# EAGLE design double-tube-iv (EAGLE 6.6.0)
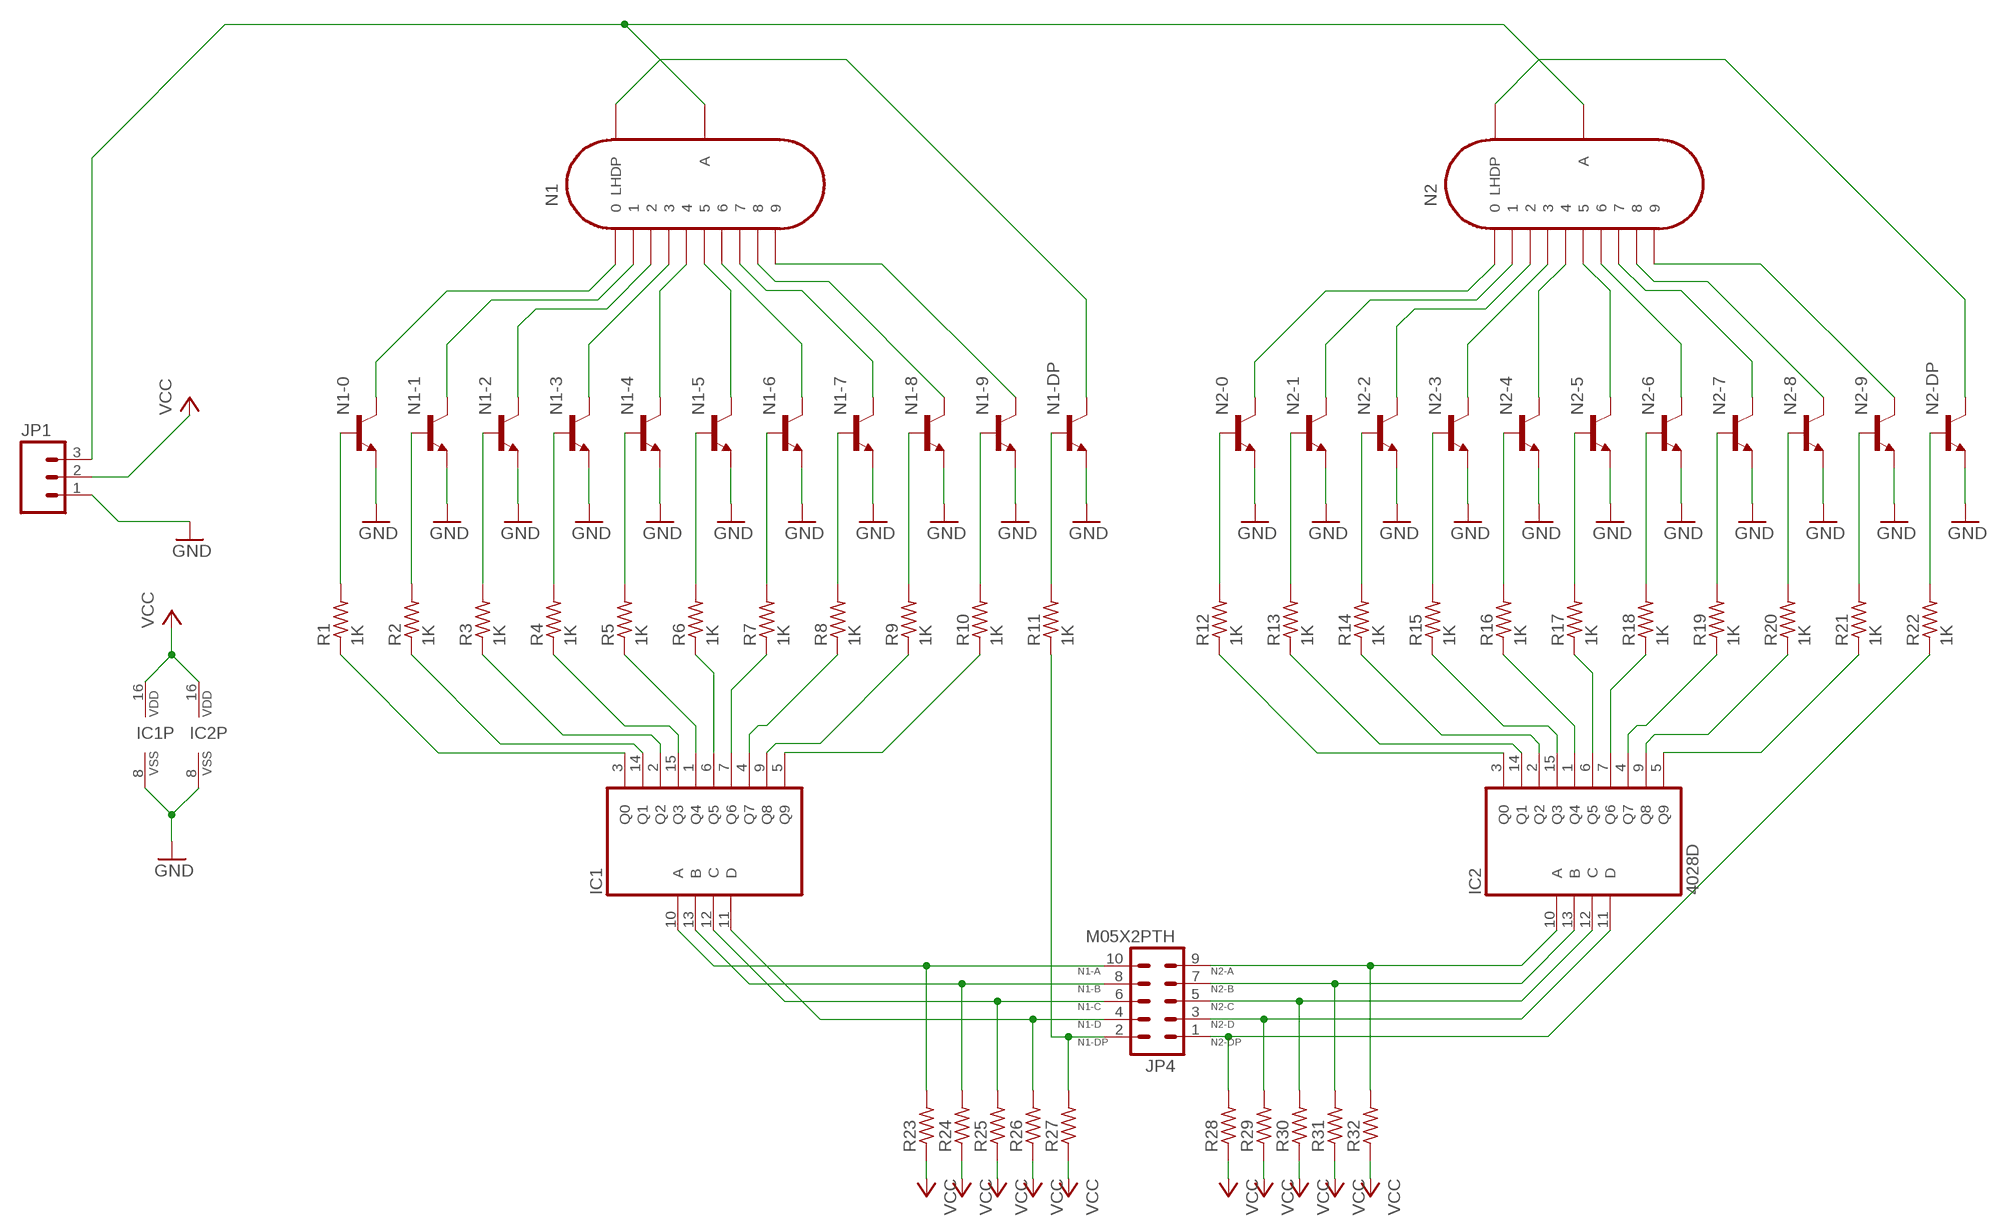
[diagram p0: schematic, sheet 1]

## Parts
IC1  4028D  [SO16]
IC2  4028D  [SO16]
JP1  M03PTH  [1X03]
JP4  M05X2PTH  [AVR_ICSP]
N1  IN-12B  [IN-12]
N1-0  NPN_SMD  [SOT-23]
N1-1  NPN_SMD  [SOT-23]
N1-2  NPN_SMD  [SOT-23]
N1-3  NPN_SMD  [SOT-23]
N1-4  NPN_SMD  [SOT-23]
N1-5  NPN_SMD  [SOT-23]
N1-6  NPN_SMD  [SOT-23]
N1-7  NPN_SMD  [SOT-23]
N1-8  NPN_SMD  [SOT-23]
N1-9  NPN_SMD  [SOT-23]
N1-DP  NPN_SMD  [SOT-23]
N2  IN-12B  [IN-12]
N2-0  NPN_SMD  [SOT-23]
N2-1  NPN_SMD  [SOT-23]
N2-2  NPN_SMD  [SOT-23]
N2-3  NPN_SMD  [SOT-23]
N2-4  NPN_SMD  [SOT-23]
N2-5  NPN_SMD  [SOT-23]
N2-6  NPN_SMD  [SOT-23]
N2-7  NPN_SMD  [SOT-23]
N2-8  NPN_SMD  [SOT-23]
N2-9  NPN_SMD  [SOT-23]
N2-DP  NPN_SMD  [SOT-23]
R1  1K  RESISTORR0603  [R0603]
R2  1K  RESISTORR0603  [R0603]
R3  1K  RESISTORR0603  [R0603]
R4  1K  RESISTORR0603  [R0603]
R5  1K  RESISTORR0603  [R0603]
R6  1K  RESISTORR0603  [R0603]
R7  1K  RESISTORR0603  [R0603]
R8  1K  RESISTORR0603  [R0603]
R9  1K  RESISTORR0603  [R0603]
R10  1K  RESISTORR0603  [R0603]
R11  1K  RESISTORR0603  [R0603]
R12  1K  RESISTORR0603  [R0603]
R13  1K  RESISTORR0603  [R0603]
R14  1K  RESISTORR0603  [R0603]
R15  1K  RESISTORR0603  [R0603]
R16  1K  RESISTORR0603  [R0603]
R17  1K  RESISTORR0603  [R0603]
R18  1K  RESISTORR0603  [R0603]
R19  1K  RESISTORR0603  [R0603]
R20  1K  RESISTORR0603  [R0603]
R21  1K  RESISTORR0603  [R0603]
R22  1K  RESISTORR0603  [R0603]
R23  RESISTORR0603  [R0603]
R24  RESISTORR0603  [R0603]
R25  RESISTORR0603  [R0603]
R26  RESISTORR0603  [R0603]
R27  RESISTORR0603  [R0603]
R28  RESISTORR0603  [R0603]
R29  RESISTORR0603  [R0603]
R30  RESISTORR0603  [R0603]
R31  RESISTORR0603  [R0603]
R32  RESISTORR0603  [R0603]

## Nets
180V: JP1.3 N1.A N2.A
GND: IC1.8(VSS) IC2.8(VSS) JP1.1 N1-0.2(E) N1-1.2(E) N1-2.2(E) N1-3.2(E) N1-4.2(E) N1-5.2(E) N1-6.2(E) N1-7.2(E) N1-8.2(E) N1-9.2(E) N1-DP.2(E) N2-0.2(E) N2-1.2(E) N2-2.2(E) N2-3.2(E) N2-4.2(E) N2-5.2(E) N2-6.2(E) N2-7.2(E) N2-8.2(E) N2-9.2(E) N2-DP.2(E)
N1-A: IC1.10(A) JP4.10 R23.2
N1-B: IC1.13(B) JP4.8 R24.2
N1-C: IC1.12(C) JP4.6 R25.2
N1-D: IC1.11(D) JP4.4 R26.2
N1-DP: JP4.2 R11.1 R27.2
N2-0: N2-0.3(C) N2.0
N2-A: IC2.10(A) JP4.9 R32.2
N2-B: IC2.13(B) JP4.7 R31.2
N2-C: IC2.12(C) JP4.5 R30.2
N2-D: IC2.11(D) JP4.3 R29.2
N2-DP: JP4.1 R22.1 R28.2
N$1: N1-0.3(C) N1.0
N$2: N1-1.3(C) N1.1
N$3: N1-2.3(C) N1.2
N$4: N1-3.3(C) N1.3
N$5: N1-4.3(C) N1.4
N$6: N1-9.3(C) N1.9
N$7: N1-8.3(C) N1.8
N$8: N1-7.3(C) N1.7
N$9: N1-6.3(C) N1.6
N$10: N1-5.3(C) N1.5
N$11: N1-DP.3(C) N1.LHDP
N$12: N1-0.1(B) R1.2
N$13: N1-1.1(B) R2.2
N$14: N1-2.1(B) R3.2
N$15: N1-3.1(B) R4.2
N$16: N1-4.1(B) R5.2
N$17: N1-5.1(B) R6.2
N$18: N1-9.1(B) R10.2
N$19: N1-6.1(B) R7.2
N$20: N1-7.1(B) R8.2
N$21: N1-8.1(B) R9.2
N$22: IC1.3(Q0) R1.1
N$23: IC1.14(Q1) R2.1
N$28: N1-DP.1(B) R11.2
N$29: IC1.2(Q2) R3.1
N$30: N2-1.3(C) N2.1
N$31: N2-2.3(C) N2.2
N$32: N2-3.3(C) N2.3
N$33: N2-4.3(C) N2.4
N$34: N2-9.3(C) N2.9
N$35: N2-8.3(C) N2.8
N$36: N2-7.3(C) N2.7
N$37: N2-6.3(C) N2.6
N$38: N2-5.3(C) N2.5
N$39: N2-DP.3(C) N2.LHDP
N$40: N2-0.1(B) R12.2
N$41: N2-1.1(B) R13.2
N$42: N2-2.1(B) R14.2
N$43: N2-3.1(B) R15.2
N$44: N2-4.1(B) R16.2
N$45: N2-5.1(B) R17.2
N$46: N2-9.1(B) R21.2
N$47: N2-6.1(B) R18.2
N$48: N2-7.1(B) R19.2
N$49: N2-8.1(B) R20.2
N$50: IC1.15(Q3) R4.1
N$55: N2-DP.1(B) R22.2
N$56: IC1.1(Q4) R5.1
N$57: IC1.6(Q5) R6.1
N$58: IC1.7(Q6) R7.1
N$59: IC1.5(Q9) R10.1
N$60: IC1.9(Q8) R9.1
N$61: IC1.4(Q7) R8.1
N$63: IC2.3(Q0) R12.1
N$64: IC2.14(Q1) R13.1
N$65: IC2.2(Q2) R14.1
N$66: IC2.15(Q3) R15.1
N$67: IC2.1(Q4) R16.1
N$68: IC2.6(Q5) R17.1
N$69: IC2.7(Q6) R18.1
N$70: IC2.5(Q9) R21.1
N$71: IC2.9(Q8) R20.1
N$72: IC2.4(Q7) R19.1
VCC: IC1.16(VDD) IC2.16(VDD) JP1.2 R23.1 R24.1 R25.1 R26.1 R27.1 R28.1 R29.1 R30.1 R31.1 R32.1

## Library data of the parts
IC1 IC2 = iStivi - ICs:4028: BCD to decimal DECODER
JP1 = iStivi - Header-Connector:M03: Header 3 Standard 3-pin 0.1" header. Use with straight break away headers (SKU : PRT-00116), right angle break away headers (PRT-00553), swiss pins (PRT-00743), machine pins (PRT-00117), and female headers (PRT-00115). Molex polarized connector foot print use with SKU : PRT-08232 with associated crimp pins and housings.
JP4 = iStivi - Header-Connector:M05X2: Header 5x2 Standard 10-pin dual row 0.1" header. Commonly used with AVR-ISP. Use with Spark Fun Electronics SKU: PRT-00778
N1 N2 = iStivi - Tubes:IN-12B: IN-12B: medium numeric topview nixie tube
N1-0 N1-1-N1-9 N1-DP N2-0 N2-1-N2-9 N2-DP = iStivi - Transistor-FET-reg:NPN_SMD: NPN Transistor NPN transistor with smd package BC817 PMBTA42
R1-R32 = iStivi - RCLD:RESISTOR: RESISTOR

## Board
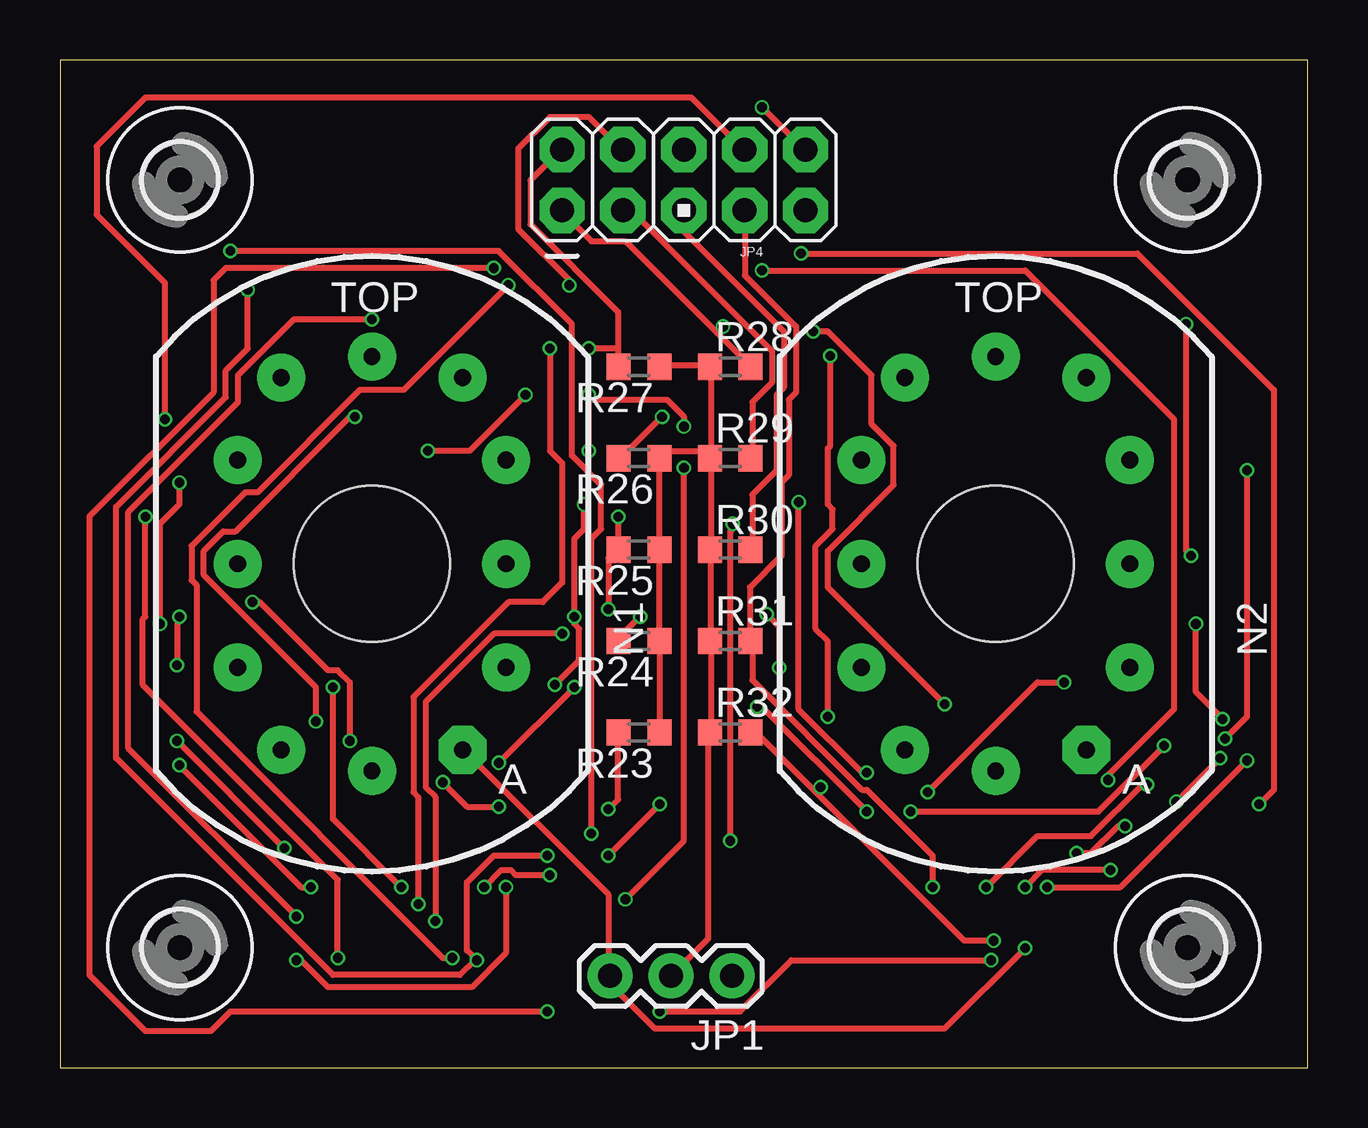
[diagram p1: board, top side]
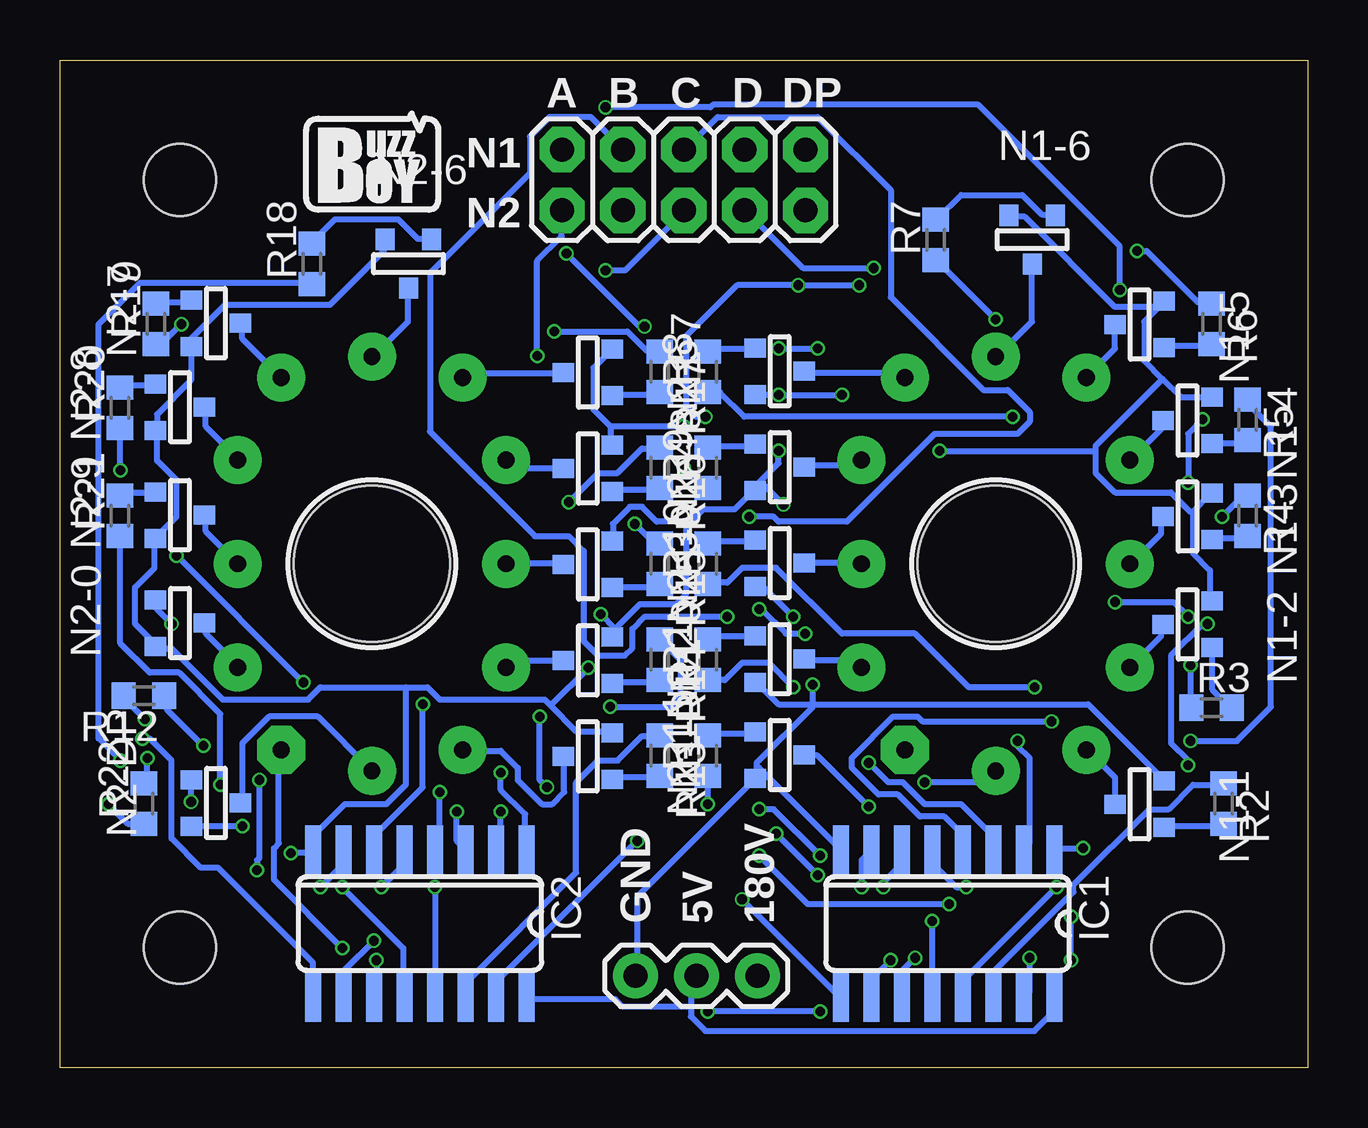
[diagram p2: board, bottom side, seen from below]

Size 52 x 42 mm. Coordinates in mm from the lower left corner, seen from the top.
Outline: 0,0 52,0 52,42 0,42 0,0
Copper layers (1*16): Top 0.035mm / dielectric 1.5mm / Bottom 0.035mm
Design rules "default *": minimum track width 10mil, minimum drill 0.4mm, track to track 8mil, track to pad 8mil, pad to pad 8mil, via to via 8mil, smd to smd 8mil, copper to edge 40mil, drill to drill 8mil, minimum pad ring 10mil, minimum via ring 4mil, stop-mask expansion 4mil, vias tented up to drill 0.5mm, thermal gap 10mil
Holes 6.5 mm at 13,21 39,21

### Footprints (pad centres in the part's own frame; a part is rotated, then mirrored left to right if it is on the bottom)
SO16 = smd 0.66 x 2.032: 1 -4.445,-3.073; 2 -3.175,-3.073; 3 -1.905,-3.073; 4 -0.635,-3.073; 5 0.635,-3.073; 6 1.905,-3.073; 7 3.175,-3.073; 8 4.445,-3.073; 9 4.445,3.073; 10 3.175,3.073; 11 1.905,3.073; 12 0.635,3.073; 13 -0.635,3.073; 14 -1.905,3.073; 15 -3.175,3.073; 16 -4.445,3.073
1X03 = drill 1 pad 1.88: 1 0,0; 2 2.54,0; 3 5.08,0
AVR_ICSP = drill 1 pad 1.88 octagon: 1 -1.27,5.08; 2 1.27,5.08; 3 -1.27,2.54; 4 1.27,2.54; 5 -1.27,0; 6 1.27,0; 7 -1.27,-2.54; 8 1.27,-2.54; 9 -1.27,-5.08; 10 1.27,-5.08
IN-12 = drill 0.7 pad 2: 0 5.59,-4.32; 1 -3.78,-7.766; 2 -5.59,-4.32; 3 -5.59,0; 4 -5.59,4.32; 5 -3.78,7.766; 6 0,8.64; 7 3.78,7.766; 8 5.59,4.32; 9 5.59,0; LHDP 0,-8.64 | drill 0.7 pad 2 octagon: A 3.78,-7.766
SOT-23 = smd 0.787 x 0.889: 1 0.991,1.016; 2 -0.94,1.016; 3 0.025,-1.016
R0603 = smd 1 x 1.1: 1 -0.85,0; 2 0.85,0
3,0-SMALL = hole 3: 0,0

### Placement (x,y rotation side)
IC1  15,6 180 bottom
IC2  37,6 180 bottom
JP1  28.01,3.82 180 top
JP4  26,37 90 top
N1  13,21 0 top
N1-0  22,17 90 bottom
N1-1  7,11 270 bottom
N1-2  5,18.5 270 bottom
N1-3  5,23 270 bottom
N1-4  5,27 270 bottom
N1-5  7,31 270 bottom
N1-6  11.5,34.51 0 bottom
N1-7  22,29 90 bottom
N1-8  22,25 90 bottom
N1-9  22,21 90 bottom
N1-DP  22,13 90 bottom
N2  39,21 0 top
N2-0  47,18.5 90 bottom
N2-1  30,13 270 bottom
N2-2  30,17 270 bottom
N2-3  30,21 270 bottom
N2-4  30,25 270 bottom
N2-5  30,29 270 bottom
N2-6  37.5,33.51 0 bottom
N2-7  45.5,31 90 bottom
N2-8  47,27.5 90 bottom
N2-9  47,23 90 bottom
N2-DP  45.5,11 90 bottom
R1  25,17 90 bottom
R2  3.5,11 270 bottom
R3  4,15 0 bottom
R4  2.5,23 270 bottom
R5  2.5,27 270 bottom
R6  4,31 270 bottom
R7  15.5,34.5 90 bottom
R8  25,29 90 bottom
R9  25,25 90 bottom
R10  25,21 90 bottom
R11  25,13 90 bottom
R12  48.5,15.5 180 bottom
R13  27,13 270 bottom
R14  27,17 270 bottom
R15  27,21 270 bottom
R16  27,25 270 bottom
R17  27,29 270 bottom
R18  41.5,33.5 90 bottom
R19  48,31 90 bottom
R20  49.5,27.5 90 bottom
R21  49.5,23 90 bottom
R22  48.5,11 90 bottom
R23  24.13,13.97 180 top
R24  24.13,17.78 180 top
R25  24.13,21.59 180 top
R26  24.13,25.4 180 top
R27  24.13,29.21 180 top
R28  27.94,29.21 0 top
R29  27.94,25.4 0 top
R30  27.94,21.59 0 top
R31  27.94,17.78 0 top
R32  27.94,13.97 0 top
U$1  [BUZZBOY-SILK]  25.71,8.65 0 top
U$2  [3,0-SMALL]  5,37 0 top
U$3  [3,0-SMALL]  47,37 0 top
U$4  [3,0-SMALL]  47,5 0 top
U$5  [3,0-SMALL]  5,5 0 top
U$6  [BUZZBOY-SILK-BOTTOM]  39.37,38.1 0 bottom

### Tracks (layer width: path | path; a pad name or v marks a point on that pad's centre or on a via)
180V  (via drill 0.4)
  Top 0.254: N1.A 16.87,13.21 22.86,7.21 22.86,3.86 JP1.3 22.96,3.76 22.96,3.45 24.79,1.63 36.88,1.63 v40.23,4.98
  Bottom 0.254: v40.23,4.98 43.08,7.82 43.08,9.14 42.88,9.35 42.88,13.21 N2.A
GND  (via drill 0.4)
  Top 0.254: v44.4,10.06 44.09,10.06 42.98,8.94 v42.37,8.94 | v22.05,25.7 v22.05,28.04 22.15,27.84 25.3,27.84 26.01,27.13 v26.01,26.72 | v20.62,15.95 21.64,16.97 21.64,18.29 21.44,18.49 v21.44,18.8 21.44,22.05 21.84,22.45 v21.84,23.47 | v15.34,25.7 17.07,25.7 v19.41,28.04 | v29.97,16.66 29.97,18.39 v29.46,18.9
  Bottom 0.254: N2-6.2 38.51,34.44 38.51,34.04 40.74,31.8 45.11,31.8 46.53,30.38 46.53,30.18 N2-7.2 46.53,29.97 46.53,28.65 47.95,27.23 47.95,26.62 N2-8.2 47.95,26.52 47.95,25.3 47.14,24.49 47.14,22.96 47.95,22.15 N2-9.2 48.06,22.05 48.06,20.83 48.87,20.02 48.87,18.49 48.06,17.68 N2-0.2 47.95,17.48 47.35,17.48 45.21,15.34 41.66,15.34 41.15,15.85 37.59,15.85 | v44.4,10.06 46.43,10.06 N2-DP.2 | v42.37,8.94 41.55,8.94 41.45,9.04 IC2.8 41.35,9.14 41.35,9.75 40.13,10.97 38.41,10.97 37.59,11.79 37.59,15.85 | 31.55,15.09 31.8,15.34 36.17,15.34 36.68,15.85 37.59,15.85 | 31.55,15.09 30.48,14.02 29.06,14.02 N2-1.2 | 4.78,23.16 4.78,21.44 4.06,20.73 4.06,19.51 N1-2.2 | 4.78,23.16 4.06,23.88 N1-3.2 | 6.04,28.7 6.81,29.46 6.81,31.09 5.99,31.9 N1-5.2 6.3,31.7 8.03,31.7 11.79,35.46 12.39,35.46 N1-6.2 | 6.04,28.7 5.28,27.94 4.06,27.94 N1-4.2 | 8.84,25.7 8.84,25.91 6.04,28.7 | 8.84,25.7 8.84,24.79 8.03,23.98 5.69,23.98 4.88,23.16 4.78,23.16 | 29.06,26.72 29.06,26.01 N2-4.2 | 29.06,26.72 29.77,27.43 29.77,29.16 29.06,29.87 N2-5.2 | 28.85,18.29 27.84,19.3 26.31,19.3 25.91,19.71 25.91,22.55 25.76,22.71 | 28.85,18.29 28.96,18.19 28.96,17.98 N2-2.2 28.85,18.29 | 25.76,22.71 25.2,23.27 23.88,23.27 23.06,24.08 N1-8.2 | N2-3.2 28.96,21.95 28.96,22.66 28.25,23.37 27.74,23.37 27.13,22.76 25.81,22.76 25.76,22.71 | v22.05,25.7 22.05,25.2 23.06,24.18 N1-8.2 | N1-7.2 22.96,28.04 v22.05,28.04 v19.41,28.04 | v26.01,26.72 29.06,26.72 | 20.62,15.14 22.05,15.14 22.96,16.05 N1-0.2 | 20.62,15.14 9.14,15.14 5.99,11.99 N1-1.2 | 22.96,12.5 22.96,12.7 20.62,15.04 20.62,15.14 | 22.96,12.5 22.96,12.09 N1-DP.2 23.06,11.99 27.94,7.11 27.94,3.86 JP1.1
  Bottom 0.254: v21.44,18.8 22.66,20.02 22.96,20.02 N1-9.2 | 20.62,15.14 v20.62,15.95 | IC1.8 19.51,9.14 22.86,12.5 22.96,12.5 | v21.84,23.47 22.76,24.38 N1-8.2 | v15.34,25.7 8.84,25.7 | v29.97,16.66 31.55,15.09 | 28.85,18.29 v29.46,18.9
N1-A  (via drill 0.4)
  Top 0.254: v22.86,10.77 23.27,11.18 23.27,13.92 R23.2 | v20.32,8.84 18.09,8.84 16.97,7.72 16.97,4.88 v17.37,4.47 17.27,4.47 16.66,3.86 11.38,3.86 2.34,12.9 2.34,23.37 6.91,27.94 6.91,29.06 7.82,29.97 v7.82,32.41 | v29.26,40.03 30.99,38.3 JP4.10
  Bottom 0.254: v22.86,10.77 22.25,10.77 v20.32,8.84 | v17.37,4.47 18.09,3.76 18.09,2.95 IC1.10 | v29.26,40.03 24.89,40.03 24.79,40.13 13.72,40.13 7.82,34.24 v7.82,32.41
N1-B  (via drill 0.4)
  Top 0.254: v24.18,18.8 23.37,17.98 23.37,17.78 R24.2 | v10.46,7.52 10.06,7.52 v4.98,12.6 | v4.17,18.49 4.17,22.66 4.98,23.47 v4.98,24.38 | v4.37,27.03 4.37,32.72 1.52,35.56 1.52,38.41 3.56,40.44 26.31,40.44 28.45,38.3 JP4.8
  Bottom 0.254: v24.18,18.8 27.64,18.8 28.14,18.29 28.14,17.48 28.45,17.17 29.57,17.17 30.18,17.78 30.18,21.54 30.79,22.15 32.21,22.15 36.58,26.52 36.58,33.12 32.41,37.29 32.41,38.81 31.6,39.62 29.87,39.62 28.55,38.3 JP4.8 | v10.46,7.52 14.33,3.66 14.33,2.95 IC1.13 | v4.98,12.6 4.98,12.8 5.69,13.51 5.69,17.17 4.37,18.49 v4.17,18.49 | v4.98,24.38 4.98,26.42 v4.37,27.03
N1-C  (via drill 0.4)
  Top 0.254: v23.27,22.96 23.27,21.64 R25.2 23.16,21.54 22.86,21.23 v22.86,19.1 | v15.65,6.1 15.65,11.28 15.24,11.68 15.24,15.24 18.09,18.09 v20.93,18.09
  Bottom 0.254: v23.27,22.96 22.25,22.96 22.05,22.76 19.2,22.76 15.54,26.42 12.09,26.42 11.58,26.92 11.58,27.33 12.5,28.25 13.51,28.25 17.37,32.11 17.37,36.58 20.42,39.62 24.59,39.62 25.91,38.3 JP4.6 | v15.65,6.1 15.65,2.95 IC1.12 | v20.93,18.09 21.74,18.09 22.76,19.1 v22.86,19.1
N1-D  (via drill 0.4)
  Top 0.254: v25.09,27.13 23.37,25.4 R26.2 | v21.23,32.61 21.23,32.82 19.1,34.95 19.1,38.3 20.42,39.62 22.05,39.62 23.37,38.3 JP4.4 | v16.36,4.57 15.95,4.57 5.69,14.83 5.69,20.12 5.49,20.32 5.49,21.74 7.72,23.98 8.23,23.98 12.5,28.25 14.33,28.25 v18.69,32.61
  Bottom 0.254: v25.09,27.13 25.5,27.13 25.91,27.53 25.91,30.48 23.77,32.61 v21.23,32.61 v18.69,32.61 | v16.36,4.57 16.87,4.06 16.87,2.95 IC1.11
N1-DP  (via drill 0.4)
  Top 0.254: 23.27,29.97 23.27,31.5 19.61,35.15 19.61,36.98 20.83,38.2 JP4.2 | 23.27,29.97 23.27,29.26 R27.2 | v22.86,8.84 v24.99,10.97 | v14.94,6.81 14.94,11.28 14.73,11.48 14.73,15.44 18.69,19.41 20.12,19.41 20.93,20.22 20.93,25.2 20.42,25.7 v20.42,29.97 | 23.27,29.97 v22.05,29.97
  Bottom 0.254: v24.99,10.97 24.99,12.09 R11.1 | v22.86,8.84 20.83,6.81 v14.94,6.81 | v22.05,29.97 v20.42,29.97
N2-0
  Bottom 0.254: N2-0.3 45.92,18.49 45.92,18.09 44.6,16.76 N2.0
N2-A  (via drill 0.4)
  Top 0.254: 31.5,11.48 37.69,5.28 v38.91,5.28 | 31.5,11.48 29.06,13.92 28.85,13.92 R32.2 | v32.11,29.67 32.11,25.91 32,25.81 32,23.47 32.21,23.27 32.21,22.45 31.5,21.74 31.5,18.29 32,17.78 v32,14.63 | 31.5,11.48 v31.7,11.68
  Bottom 0.254: v38.91,5.28 40.13,4.06 40.13,2.95 IC2.10 | v32.11,29.67 32.11,33.63 31.09,34.65 31.09,35.66 JP4.9 | v32,14.63 32,11.99 v31.7,11.68
N2-B  (via drill 0.4)
  Top 0.254: JP4.7 28.55,35.66 28.55,33.02 30.68,30.89 30.68,28.14 30.38,27.84 30.38,24.69 30.07,24.38 30.07,21.34 28.75,20.02 28.75,17.78 R31.2 28.85,17.68 28.85,16.15 33.43,11.58 33.63,11.58 36.37,8.84 v36.37,7.52
  Bottom 0.254: v36.37,7.52 36.37,2.95 IC2.13
N2-C  (via drill 0.4)
  Top 0.254: R30.2 28.85,21.64 28.85,23.88 29.87,24.89 29.87,28.04 30.18,28.35 30.18,30.68 26.01,34.85 26.01,35.66 JP4.5 | v40.23,7.52 40.95,8.23 v43.79,8.23 | v43.69,11.99 43.69,12.19 46.43,14.94 46.43,27.03 40.23,33.22 v29.26,33.22
  Bottom 0.254: v40.23,7.52 37.69,4.98 37.69,2.95 IC2.12 | v43.79,8.23 43.79,8.64 43.69,8.74 v43.69,11.99 | v29.26,33.22 28.45,33.22 26.01,35.66 JP4.5
N2-D  (via drill 0.4)
  Top 0.254: R29.2 28.85,25.4 28.85,27.74 29.67,28.55 29.67,29.87 23.88,35.66 23.47,35.66 JP4.3 | v38.81,4.47 30.48,4.47 28.35,2.34 v24.99,2.34 | v20.32,2.34 7.11,2.34 6.3,1.52 3.56,1.52 1.22,3.86 1.22,22.96 6.4,28.14 6.4,32.82 6.91,33.33 v18.09,33.33
  Bottom 0.254: v38.81,4.47 38.81,2.95 IC2.11 | v20.32,2.34 v24.99,2.34 | v18.09,33.33 21.03,33.33 23.37,35.66 JP4.3
N2-DP  (via drill 0.4)
  Top 0.254: 27.38,30.63 23.57,34.44 22.15,34.44 20.93,35.66 JP4.1 | 27.38,30.63 28.75,29.26 R28.2 | v49.99,10.97 50.6,11.58 50.6,28.25 44.91,33.93 v30.89,33.93 | 27.38,30.63 v27.64,30.89
  Bottom 0.254: v49.99,10.97 49.17,10.16 48.56,10.16 R22.1 | v30.89,33.93 27.84,30.89 v27.64,30.89
N$1
  Bottom 0.254: N1-0.3 20.93,16.97 18.8,16.97 18.59,16.76 N1.0
N$2
  Bottom 0.254: N1-1.3 8.03,11.07 8.03,12.09 9.14,13.21 N1.1
N$3
  Bottom 0.254: N1-2.3 6.1,18.39 6.1,17.98 7.32,16.76 N1.2
N$4
  Bottom 0.254: N1-3.3 6.1,22.96 6.1,22.25 7.32,21.03 N1.3
N$5
  Bottom 0.254: N1-4.3 6.1,26.92 6.1,26.62 7.32,25.4 N1.4
N$6
  Bottom 0.254: N1-9.3 20.93,21.03 18.59,21.03 N1.9
N$7
  Bottom 0.254: N1-8.3 20.93,25.09 18.8,25.09 18.59,25.3 N1.8
N$8
  Bottom 0.254: N1-7.3 20.93,28.96 16.97,28.96 16.87,28.85 N1.7
N$9
  Bottom 0.254: N1-6.3 11.48,33.43 11.48,31.09 12.9,29.67 N1.6
N$10
  Bottom 0.254: N1-5.3 8.03,30.89 8.03,29.97 9.14,28.85 N1.5
N$11  (via drill 0.4)
  Top 0.254: v18.29,10.87 16.97,10.87 v15.95,11.89
  Bottom 0.254: v18.29,10.87 20.42,13.01 20.93,13.01 N1-DP.3 | v15.95,11.89 13.41,11.89 13.01,12.29 N1.LHDP
N$12
  Bottom 0.254: N1-0.1 23.06,17.98 24.89,17.98 24.99,17.88 R1.2
N$13
  Bottom 0.254: N1-1.1 5.89,10.06 3.56,10.06 R2.2
N$14
  Bottom 0.254: N1-2.1 3.96,17.48 3.96,15.75 3.25,15.04 R3.2
N$15
  Bottom 0.254: N1-3.1 3.96,22.05 2.64,22.05 2.54,22.15 R4.2
N$16
  Bottom 0.254: N1-4.1 3.96,26.01 2.64,26.01 2.54,26.11 R5.2
N$17
  Bottom 0.254: N1-5.1 5.89,30.07 4.06,30.07 R6.2
N$18
  Bottom 0.254: N1-9.1 23.06,21.95 24.99,21.95 R10.2
N$19
  Bottom 0.254: N1-6.1 10.57,35.56 11.07,35.56 11.89,36.37 14.43,36.37 15.44,35.36 R7.2
N$20
  Bottom 0.254: N1-7.1 23.06,29.97 24.89,29.97 24.99,29.87 R8.2
N$21
  Bottom 0.254: N1-8.1 23.06,25.91 24.99,25.91 R9.2
N$22  (via drill 0.4)
  Top 0.254: v18.29,12.7 v21.44,15.85
  Bottom 0.254: v21.44,15.85 22.45,16.87 23.57,16.87 24.28,16.15 R1.1 | v18.29,12.7 17.48,11.89 16.87,11.89 15.95,10.97 14.43,10.97 13.11,9.65 13.11,9.14 IC1.3
N$23
  Bottom 0.254: R2.1 3.56,11.79 4.78,11.79 5.79,10.77 6.6,10.77 9.75,7.62 9.75,7.32 13.01,4.06 13.01,2.95 IC1.14
N$28
  Bottom 0.254: N1-DP.1 23.06,13.92 24.99,13.92 R11.2
N$29  (via drill 0.4)
  Top 0.254: v4.88,16.76 4.88,18.69 v4.98,18.8 | v8.03,19.41 8.33,19.41 11.18,16.56 11.58,16.56 12.09,16.05 v12.09,13.61
  Bottom 0.254: v4.88,16.76 4.88,15.04 R3.1 | v4.98,18.8 5.59,19.41 v8.03,19.41 | v12.09,13.61 12.09,13.41 11.58,12.9 11.58,9.35 11.79,9.14 IC1.2
N$30
  Bottom 0.254: N2-1.3 30.99,12.9 30.99,11.48 31.5,10.97 31.9,10.97 32.92,11.99 32.92,12.5 33.63,13.21 35.15,13.21 N2.1
N$31
  Bottom 0.254: N2-2.3 31.09,16.97 33.12,16.97 33.33,16.76 N2.2
N$32
  Bottom 0.254: N2-3.3 31.09,21.03 33.33,21.03 N2.3
N$33
  Bottom 0.254: N2-4.3 31.09,24.99 33.02,24.99 33.33,25.3 N2.4
N$34
  Bottom 0.254: N2-9.3 45.92,22.96 45.92,22.35 44.6,21.03 N2.9
N$35
  Bottom 0.254: N2-8.3 45.92,27.43 45.92,26.72 44.6,25.4 N2.8
N$36
  Bottom 0.254: N2-7.3 44.4,30.99 44.4,30.38 42.88,28.85 N2.7
N$37
  Bottom 0.254: N2-6.3 37.49,32.41 37.49,31.09 38.91,29.67 N2.6
N$38
  Bottom 0.254: N2-5.3 31.09,28.96 35.05,28.96 35.15,28.85 N2.5
N$39
  Bottom 0.254: N2-DP.3 44.4,11.07 44.4,13.51 43.28,14.63 41.25,14.63 39.01,12.39 N2.LHDP
N$40  (via drill 0.4)
  Top 0.254: v47.35,18.49 47.35,15.65 v48.46,14.53
  Bottom 0.254: v47.35,18.49 47.95,19.1 47.95,19.41 N2-0.1 | v48.46,14.53 49.38,15.44 R12.2
N$41
  Bottom 0.254: N2-1.1 28.96,12.09 27.03,12.09 R13.2
N$42
  Bottom 0.254: N2-2.1 28.96,16.05 27.03,16.05 R14.2
N$43
  Bottom 0.254: N2-3.1 28.96,20.02 27.13,20.02 27.03,20.12 R15.2
N$44
  Bottom 0.254: N2-4.1 28.96,24.08 27.03,24.08 R16.2
N$45
  Bottom 0.254: N2-5.1 28.96,28.04 27.13,28.04 27.03,28.14 R17.2
N$46
  Bottom 0.254: N2-9.1 48.06,23.98 49.38,23.98 49.48,23.88 R21.2
N$47
  Bottom 0.254: N2-6.1 36.58,34.54 37.08,34.54 37.9,35.36 40.54,35.36 41.45,34.44 R18.2
N$48
  Bottom 0.254: N2-7.1 46.53,31.9 47.95,31.9 R19.2
N$49
  Bottom 0.254: N2-8.1 48.06,28.45 49.48,28.45 R20.2
N$50  (via drill 0.4)
  Top 0.254: v3.56,22.96 3.56,18.8 3.45,18.69 3.45,15.95 11.58,7.82 v11.58,4.57
  Bottom 0.254: v3.56,22.96 2.74,23.77 2.54,23.77 R4.1 | v11.58,4.57 11.58,3.15 11.79,2.95 IC1.15
N$55  (via drill 0.4)
  Top 0.254: v48.36,12.9 v46.53,11.07
  Bottom 0.254: v46.53,11.07 46.53,11.99 N2-DP.1 | v48.36,12.9 48.36,11.99 48.46,11.89 R22.2
N$56  (via drill 0.4)
  Top 0.254: v9.35,9.14 v4.88,13.61
  Bottom 0.254: v4.88,13.61 2.95,13.61 1.52,15.04 1.52,26.72 2.44,27.64 2.44,27.84 R5.1 | v9.35,9.14 10.46,9.14 IC1.1
N$57  (via drill 0.4)
  Top 0.254: v7.11,34.04 18.29,34.04 21.34,30.99 21.34,25.5 22.55,24.28 22.55,22.45 22.15,22.05 v22.15,9.75 | v20.42,8.03 19,8.03 18.8,8.23 18.39,8.23 v17.68,7.52
  Bottom 0.254: v7.11,34.04 6.71,34.04 4.57,31.9 4.06,31.9 R6.1 | v20.42,8.03 v22.15,9.75 | v17.68,7.52 17.68,7.72 16.97,8.43 16.97,9.04 IC1.6
N$58  (via drill 0.4)
  Top 0.254: v13.01,31.19 9.75,31.19 7.42,28.85 7.42,27.74 2.85,23.16 2.85,13.31 v9.86,6.3 | v9.86,4.47 10.06,4.47 11.18,3.35 17.17,3.35 18.59,4.78 v18.59,7.52
  Bottom 0.254: v13.01,31.19 15.44,33.63 R7.1 | v9.86,4.47 v9.86,6.3 | v18.59,7.52 18.59,8.64 18.19,9.04 IC1.7
N$59  (via drill 0.4)
  Top 0.254: v11.38,15.85 11.38,10.36 v14.22,7.52
  Bottom 0.254: v11.38,15.85 14.12,15.85 16.36,18.09 19.41,18.09 22.15,20.83 23.57,20.83 24.18,20.22 24.99,20.22 R10.1 | v14.22,7.52 14.63,7.52 15.54,8.43 15.54,9.04 IC1.5
N$60  (via drill 0.4)
  Top 0.254: v26.01,24.99 26.01,9.45 v23.57,7.01
  Bottom 0.254: v26.01,24.99 25.91,24.99 25.09,24.18 R9.1 | v23.57,7.01 19.51,2.95 IC1.9
N$61  (via drill 0.4)
  Top 0.254: v12.29,27.13 12.09,27.13 7.32,22.35 6.81,22.35 5.99,21.54 5.99,20.52 10.67,15.85 v10.67,14.43
  Bottom 0.254: v12.29,27.13 23.47,27.13 24.49,28.14 R8.1 | v10.67,14.43 16.05,14.43 16.26,14.63 17.27,14.63 19,12.9 19,12.5 17.88,11.38 17.07,11.38 16.15,10.46 15.14,10.46 14.43,9.75 14.43,9.14 IC1.4
N$63  (via drill 0.4)
  Top 0.254: v46.02,13.41 43.28,10.67 v35.46,10.67
  Bottom 0.254: v46.02,13.41 47.55,14.94 47.55,15.44 R12.1 | v35.46,10.67 35.46,9.45 35.15,9.14 IC2.3
N$64
  Bottom 0.254: R13.1 27.03,13.82 27.74,13.82 28.75,12.8 29.57,12.8 30.48,11.89 30.48,8.13 35.05,3.56 35.05,2.95 IC2.14
N$65  (via drill 0.4)
  Top 0.254: v29.06,15.04 29.26,15.04 v33.63,10.67
  Bottom 0.254: v29.06,15.04 26.52,15.04 26.11,15.44 26.11,16.97 26.92,17.78 R14.1 | v33.63,10.67 33.63,9.25 33.73,9.14 IC2.2
N$66  (via drill 0.4)
  Top 0.254: v28.04,22.66 28.04,22.45 27.94,22.35 v27.94,9.45
  Bottom 0.254: v28.04,22.66 27.33,21.95 27.03,21.95 R15.1 | v27.94,9.45 33.73,3.66 33.73,2.95 IC2.15
N$67  (via drill 0.4)
  Top 0.254: v30.79,23.57 30.79,14.94 33.43,12.29 v33.63,12.29
  Bottom 0.254: v30.79,23.57 29.57,24.79 28.75,24.79 27.74,25.81 27.03,25.81 R16.1 | v33.63,12.29 33.63,11.58 32.61,10.57 32.61,9.14 IC2.1
N$68  (via drill 0.4)
  Top 0.254: v31.39,30.68 32,30.68 33.83,28.85 33.83,26.82 34.75,25.91 34.75,24.28 32,21.54 32,20.02 v36.88,15.14
  Bottom 0.254: v31.39,30.68 28.35,30.68 27.53,29.87 27.03,29.87 R17.1 | v36.88,15.14 36.88,11.68 38.81,9.75 38.81,9.14 IC2.6
N$69  (via drill 0.4)
  Top 0.254: v49.48,12.8 44.2,7.52 v41.15,7.52
  Bottom 0.254: v49.48,12.8 50.39,13.72 50.39,30.99 48.67,32.72 41.55,32.72 R18.1 | v41.15,7.52 40.23,8.43 40.23,9.04 IC2.7
N$70  (via drill 0.4)
  Top 0.254: v45.31,11.79 45.11,11.79 42.98,9.65 40.74,9.65 v38.61,7.52
  Bottom 0.254: v45.31,11.79 45.31,14.73 47.04,16.46 48.26,16.46 49.48,17.68 49.48,22.15 R21.1 | v38.61,7.52 37.69,8.43 37.69,9.04 IC2.5
N$71  (via drill 0.4)
  Top 0.254: v49.48,24.89 49.48,14.63 v48.56,13.72
  Bottom 0.254: v49.48,24.89 49.48,26.62 R20.1 | v48.56,13.72 48.26,13.72 47.35,12.8 47.35,9.55 46.13,8.33 45.41,8.33 41.45,4.37 41.45,2.95 IC2.9
N$72  (via drill 0.4)
  Top 0.254: v46.94,30.99 46.94,21.54 v47.14,21.34 | v41.86,16.05 40.74,16.05 v36.17,11.48
  Bottom 0.254: v46.94,30.99 47.75,30.18 47.95,30.18 R19.1 | v41.86,16.05 v47.14,21.34 | v36.17,11.48 36.17,9.25 36.27,9.14 IC2.4
VCC
  Top 0.254: R29.1 27.13,25.4 27.13,29.16 R28.1 27.03,29.26 24.99,29.26 R27.1 | R23.1 24.99,14.02 24.99,17.78 R24.1 24.99,17.88 24.99,21.54 R25.1 24.99,21.64 24.99,25.4 R26.1 25.09,25.4 25.4,25.7 27.03,25.7 R29.1 | R29.1 27.13,25.3 27.13,21.64 R30.1 27.13,21.54 27.13,17.88 R31.1 27.13,17.78 27.13,14.02 R32.1 27.03,13.92 27.03,5.38 25.5,3.86 JP1.2
  Bottom 0.254: 25.7,2.54 25.7,3.56 25.5,3.76 JP1.2 | 25.7,2.54 25.7,2.13 25.09,1.52 11.38,1.52 10.57,2.34 10.57,2.85 IC1.16 | 25.7,2.54 28.55,2.54 28.85,2.85 32.51,2.85 IC2.16

### Text on the board
_tplace: DUAL TUBE / BOARD | TOP | TOP | A | A | N1 | N2
_bplace: DP | D | C | B | A | N1 | N2 | 180V | 5V | GND